# EAGLE design Amulet_watch_kite.d_companion (EAGLE 7.7.0)
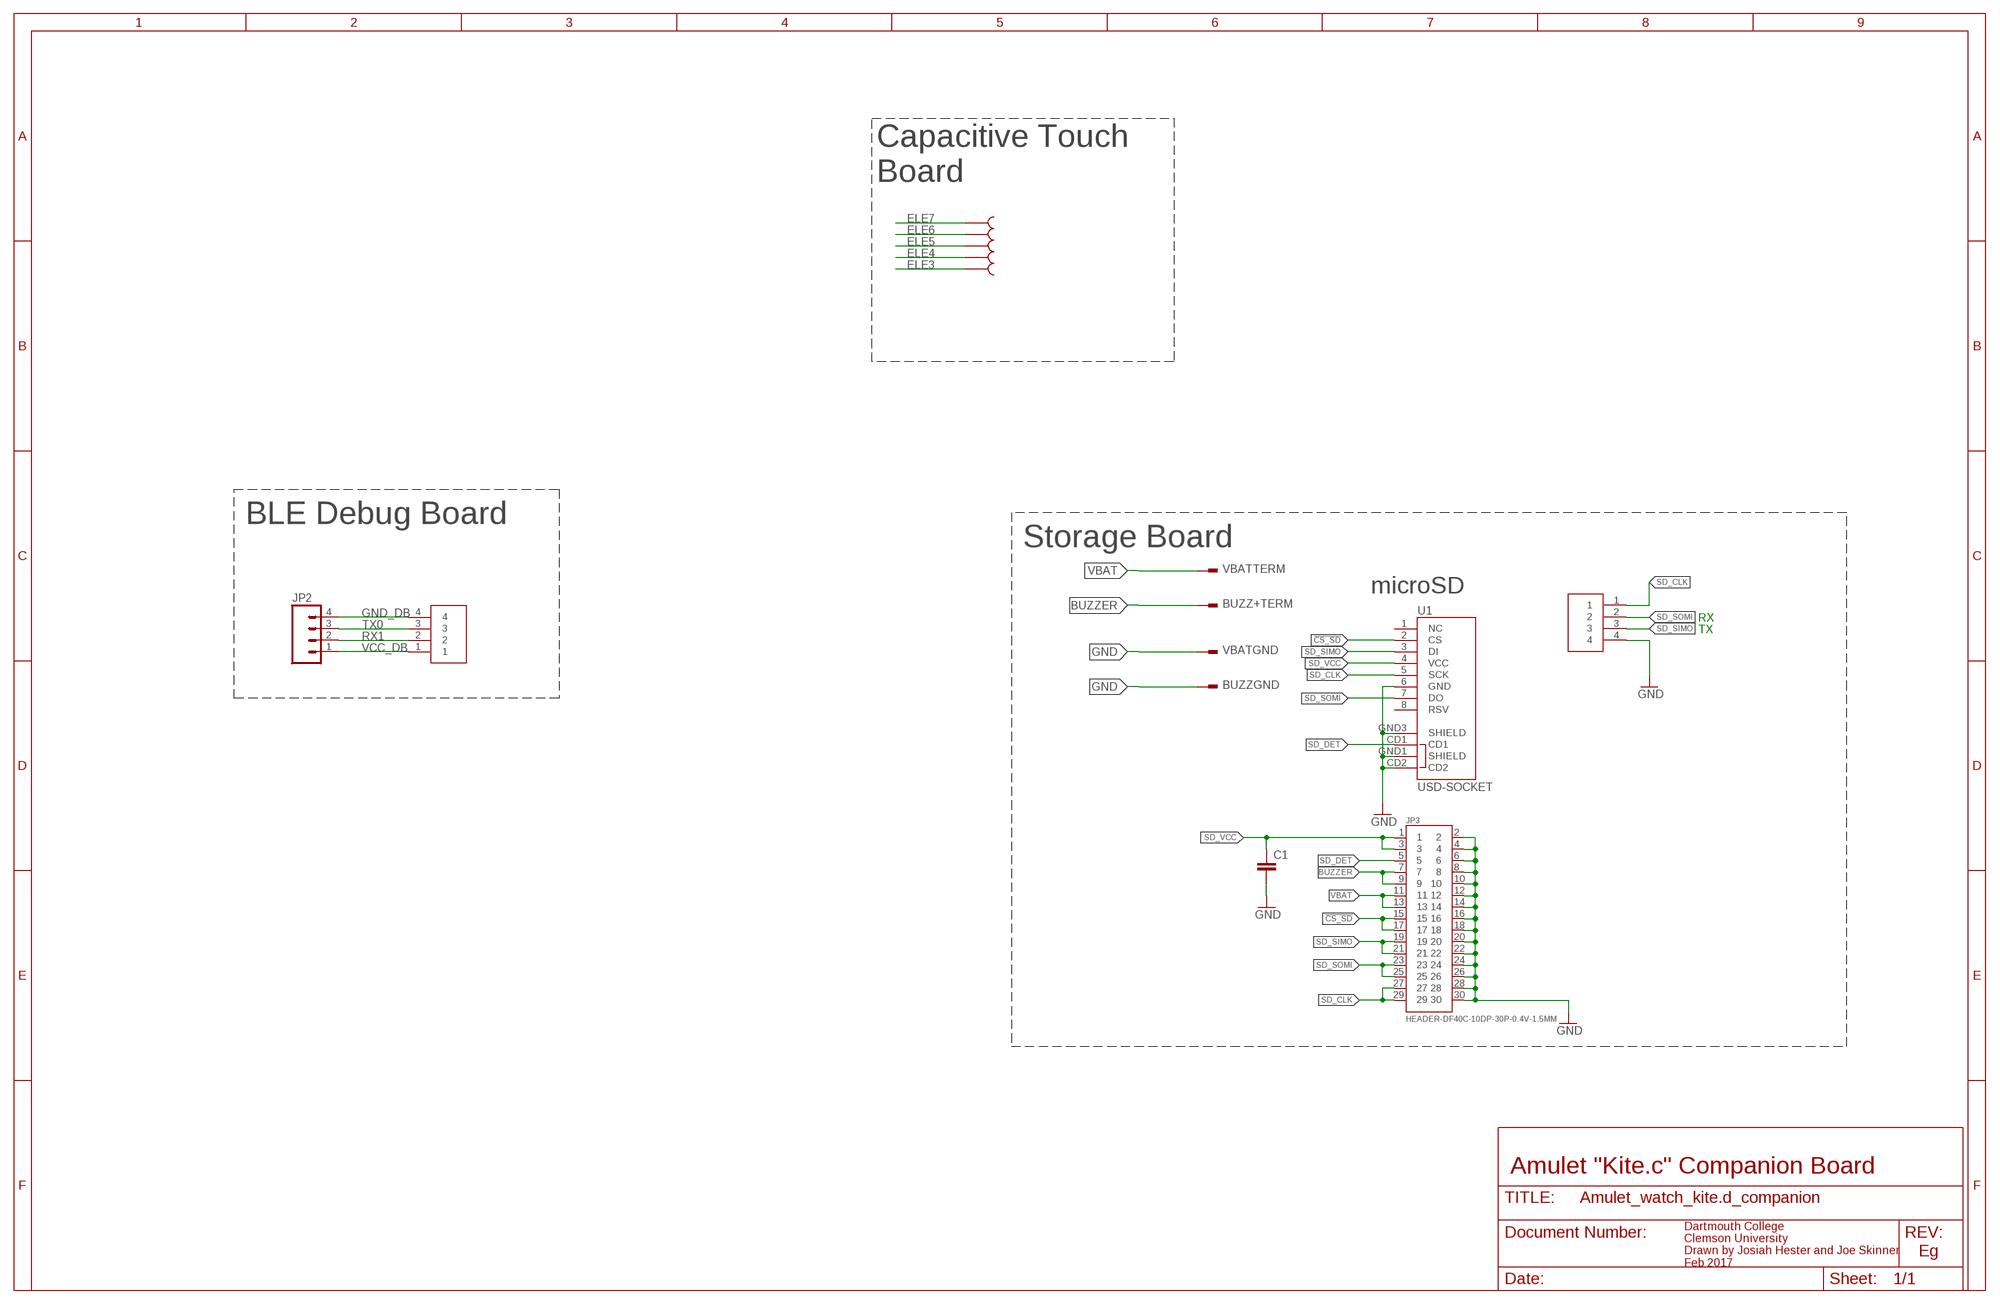
[diagram p0: schematic, sheet 1]

## Parts
BUZZ+TERM  KITE.C.TERMINAL  [BATTERY_TERMINAL]
BUZZGND  KITE.C.TERMINAL  [BATTERY_TERMINAL]
C1  CAP0805  [0805]
JP2  M04LOCK  [1X04_LOCK]
JP3  HEADER-DF40C-10DP-30P-0.4V-1.5MM  [HEADER-DF40-30]
U1  USD-SOCKET  [MICROSD_1:1]
U$1  CTPAD  [CTPAD]
U$2  CTPAD  [CTPAD]
U$3  CTPAD  [CTPAD]
U$4  CTPAD  [CTPAD]
U$5  CTPAD  [CTPAD]
U$11  1.27MM-MILLMAX  [1X03-1.27MM]
U$12  1.27MM-MILLMAX  [1X03-1.27MM]
VBATGND  KITE.C.TERMINAL  [BATTERY_TERMINAL]
VBATTERM  KITE.C.TERMINAL  [BATTERY_TERMINAL]

## Nets
!CS_SD: JP3.15 JP3.17 U1.2(CS)
BUZZER: BUZZ+TERM.P1 JP3.7 JP3.9
ELE3: U$5.P$1
ELE4: U$4.P$1
ELE5: U$3.P$1
ELE6: U$2.P$1
ELE7: U$1.P$1
GND: BUZZGND.P1 C1.2 JP3.2 JP3.4 JP3.6 JP3.8 JP3.10 JP3.12 JP3.14 JP3.16 JP3.18 JP3.20 JP3.22 JP3.24 JP3.26 JP3.28 JP3.30 U1.6(GND) U1.CD2 U1.GND1(SHIELD) U1.GND3(SHIELD) U$11.4 VBATGND.P1
GND_DB: JP2.4 U$12.4
RX1: JP2.2 U$12.2
SD_CLK: JP3.27 JP3.29 U1.5(SCK) U$11.1
SD_DET: JP3.5 U1.CD1
SD_SIMO: JP3.19 JP3.21 U1.3(DI) U$11.3
SD_SOMI: JP3.23 JP3.25 U1.7(DO) U$11.2
SD_VCC: C1.1 JP3.1 JP3.3 U1.4(VCC)
TX0: JP2.3 U$12.3
VBAT: JP3.11 JP3.13 VBATTERM.P1
VCC_DB: JP2.1 U$12.1
Unconnected: U1.1(NC) U1.8(RSV)

## Notes on the sheet
- Capacitive Touch
  Board
- BLE Debug Board
- Storage Board
- microSD
- RX
- TX
- Amulet "Kite.c" Companion Board
- Eg
- Dartmouth College
  Clemson University
  Drawn by Josiah Hester and Joe Skinner
  Feb 2017

## Library data of the parts
BUZZ+TERM BUZZGND VBATGND VBATTERM = CustomElectrodes:KITE.C.TERMINAL
C1 = SparkFun-Capacitors:CAP: Capacitor Standard 0603 ceramic capacitor, and 0.1" leaded capacitor.
JP2 = SparkFun-Connectors:M04: Header 4 Standard 4-pin 0.1" header. Use with straight break away headers (SKU : PRT-00116), right angle break away headers (PRT-00553), swiss pins (PRT-00743), machine pins (PRT-00117), and female headers (PRT-00115). Molex polarized connector foot print use with SKU : PRT-08231 with associated crimp pins and housings. 1MM SMD Version SKU: PRT-10208
JP3 = connectors:HEADER-DF40C-10DP-30P-0.4V-1.5MM: DF40 Series●0.4mm Pitch, 1.5 to 4.0mm Height, Board-to-Board and Board-to-FPC Connector 1.5mm Header (For use with shielded product) Digi-Key Part Number H11622CT-ND Quantity Available 3,874 Can ship immediately Manufacturer Hirose Electric Co Ltd </en/supplier-centers/h/hirose> Manufacturer Part Number DF40C-30DP-0.4V(51) Description 30 Position Connector Plug, Outer Shroud Contacts Surface Mount Gold Lead Free Status / RoHS Status Lead free / RoHS Compliant Moisture Sensitivity Level (MSL) 1 (Unlimited) Manufacturer Standard Lead Time 8 Weeks; DIGIKEY: H11622CT-ND
U1 = SparkFun-Connectors:USD-SOCKET: microSD Socket Push-push type uSD socket. Schematic element and footprint production proven. Spark Fun Electronics SKU : PRT-00127. tDoc lines correctly indicate media card edge positions when inserting (unlocked, locked, depressed). NOTE: CD1 and CD2 are connected internally; PROD_ID: CONN-07820
U$1-U$5 = captouch:CTPAD
U$11 U$12 = 1.27mm-headers:1.27MM-MILLMAX: Manafacturer: Mill-Max Manufacturing Corp. Manafacturer Part #: 851-13-004-40-001000 Description: 4 Position Receptacle Connector 0.050" (1.27mm) Surface Mount, Right Angle Gold; DIGIKEY: ED1324-ND

## Board
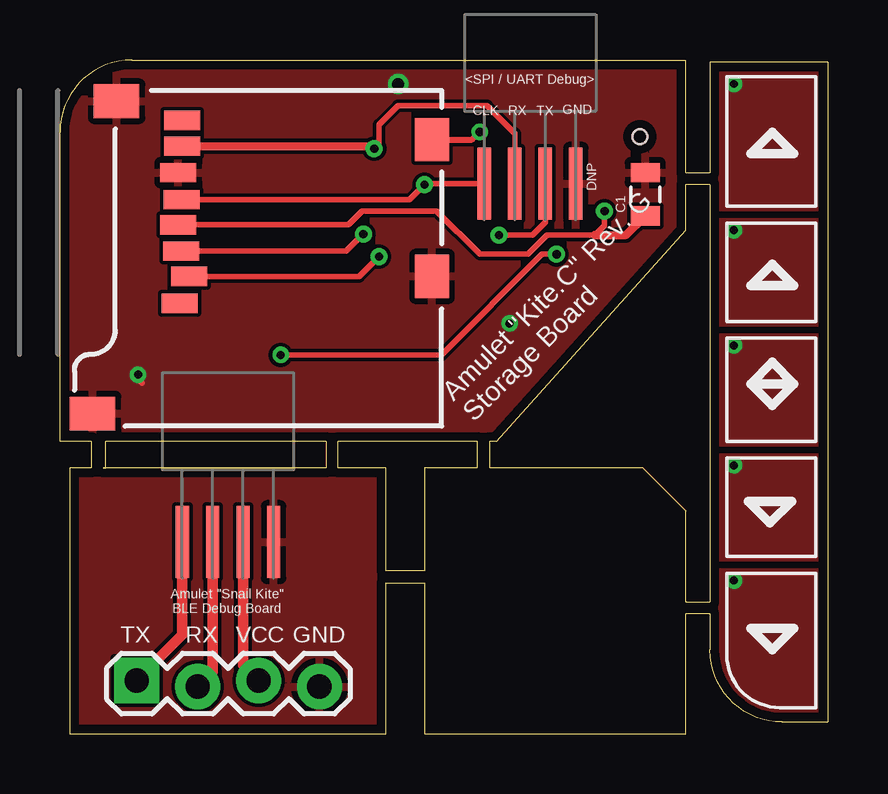
[diagram p1: board, top side]
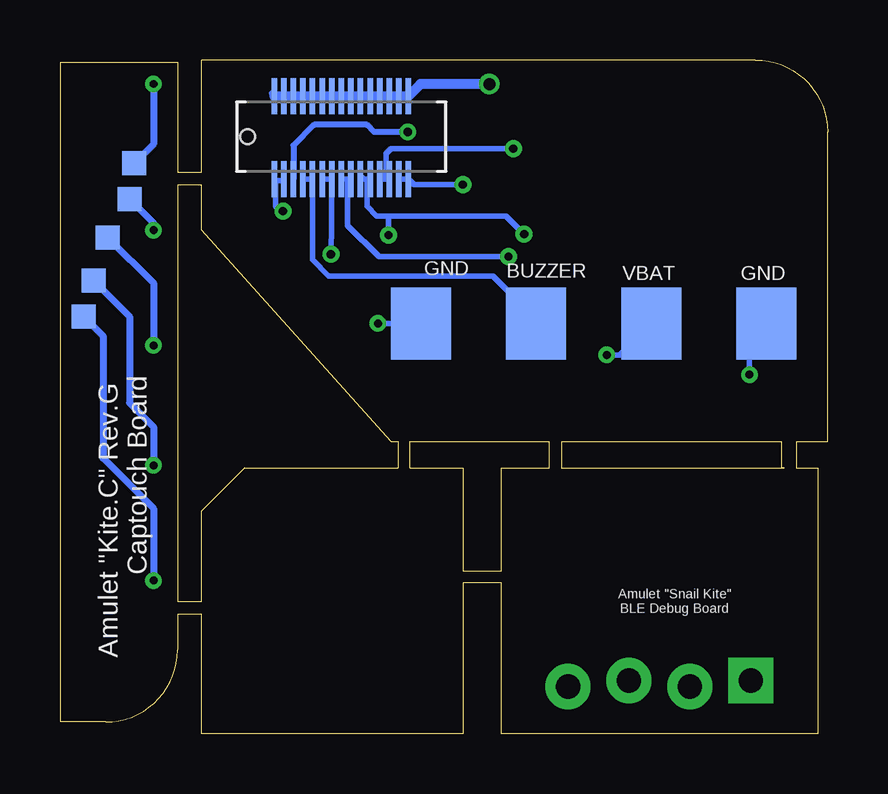
[diagram p2: board, bottom side, seen from below]

Size 32 x 28.1 mm. Coordinates in mm from the lower left corner, seen from the top.
Outline: 0,12.2 0,25.1 arc-90 3,28.1 26.1,28.1 26.1,23.4 27.1,23.4 27.1,28 32,28 32,0.5 30.1,0.5 arc-90 27.1,3.5 27.1,5 26.1,5 26.1,0 15.2,0 15.2,6.3 13.6,6.3 13.6,0 0.4,0 0.4,11.1 1.3,11.1 1.3,12.2 0,12.2
Outline: 18.2,12.2 17.9,12.2 17.9,11.1 19.4,11.1 20.1,11.1 24.3,11.1 26.1,9.3 26.1,5.5 27.1,5.5 27.1,22.9 26.1,22.9 26.1,21 18.2,12.2
Outline: 17.4,12.2 16.1,12.2 15.4,12.2 11.6,12.2 11.6,11.1 13.6,11.1 13.6,6.8 15.2,6.8 15.2,11.1 17.4,11.1 17.4,12.2
Outline: 11.1,12.2 1.9,12.2 1.9,11.1 1.8,11.1 11.1,11.1 11.1,12.2
Copper layers (1+16): Top 0.0356mm / dielectric 1.5011mm / Bottom 0.0356mm
Design rules "LaenPCBOrder *": minimum track width 6mil, minimum drill 13mil, track to track 6mil, track to pad 6mil, pad to pad 6mil, via to via 6mil, smd to smd 6mil, copper to edge 15mil, drill to drill 6mil, minimum pad ring 7mil, minimum via ring 7mil, stop-mask expansion 3mil, vias tented up to drill 0mil, thermal gap 10mil

### Footprints (pad centres in the part's own frame; a part is rotated, then mirrored left to right if it is on the bottom)
BATTERY_TERMINAL = smd 2.5 x 3: P1 0,0
0805 = smd 0.8 x 1.2: 1 -0.9,0; 2 0.9,0
1X04_LOCK = drill 1.016 pad 1.88 square: 1 0,0.127 | drill 1.016 pad 1.88: 2 2.54,-0.127; 3 5.08,0.127; 4 7.62,-0.127
HEADER-DF40-30 = smd 0.23 x 1.5: 1 -2.8,-1.76; 2 -2.8,1.7; 3 -2.4,-1.76; 4 -2.4,1.7; 5 -2,-1.76; 6 -2,1.7; 7 -1.6,-1.76; 8 -1.6,1.7; 9 -1.2,-1.76; 10 -1.2,1.7; 11 -0.8,-1.76; 12 -0.8,1.7; 13 -0.4,-1.76; 14 -0.4,1.7; 15 0,-1.76; 16 0,1.7; 17 0.4,-1.76; 18 0.4,1.7; 19 0.8,-1.76; 20 0.8,1.7; 21 1.2,-1.76; 22 1.2,1.7; 23 1.6,-1.76; 24 1.6,1.7; 25 2,-1.76; 26 2,1.7; 27 2.4,-1.76; 28 2.4,1.7; 29 2.8,-1.76; 30 2.8,1.7 | hole 0.6: -3.905,0
MICROSD_1:1 = smd 0.8 x 1.5: 1 5.096,10.919; 2 6.218,10.519; 3 7.274,10.853; 4 8.367,10.982; 5 9.421,10.828; 6 10.539,10.973; 7 11.648,10.819; 8 12.721,10.819 | smd 1.8 x 1.4: CD1 11.92,0.4; CD2 6.22,0.4 | smd 1.4 x 1.9: GND1 0.497,14.55; GND3 13.52,13.55
CTPAD = smd 1 x 1: P$1 0,0
1X03-1.27MM = smd 3 x 0.56: 1 -1.5,-1.905; 2 -1.5,-0.635; 3 -1.5,0.635; 4 -1.5,1.905

### Placement (x,y rotation side)
BUZZ+TERM  12.15,17.11 0 bottom
BUZZGND  16.95,17.11 0 bottom
C1  24.4,22.5 90 top
JP2  3.2,2.1 0 top
JP3  20.27,24.9 0 bottom
U1  15.91,12.86 90 top
U$1  31,17.4 0 bottom
U$2  30.6,18.9 0 bottom
U$3  30,20.7 0 bottom
U$4  29.1,22.3 0 bottom
U$5  28.9,23.8 0 bottom
U$11  19.6,21.44 270 top
U$12  7,6.5 270 top
VBATGND  2.54,17.11 0 bottom
VBATTERM  7.35,17.11 0 bottom

### Tracks (layer width: path | path; a pad name or v marks a point on that pad's centre or on a via)
!CS_SD  (via drill 0.35)
  Top 0.222: U1.2 12.48,19.08 v13.3,19.9
  Bottom 0.222: JP3.15 JP3.17 20,23.01 20,21.2 18.7,19.9 v13.3,19.9
BUZZER
  Bottom 0.222: JP3.7 JP3.9 21.47,19.77 20.8,19.1 13.96,19.1 12.15,17.29 BUZZ+TERM.P1
ELE3  (via drill 0.33)
  Bottom 0.3: v28.1,27.1 28.1,24.6 U$5.P$1
  pour Top: 27.2,28 32.1,28 32.1,21.9 27.2,21.9
ELE4  (via drill 0.33)
  Bottom 0.3: U$4.P$1 28.1,21.3 v28.1,21
  pour Top: 27.2,21.4 32.1,21.4 32.1,17.1 27.2,17.1
ELE5  (via drill 0.33)
  Bottom 0.3: U$3.P$1 28.1,18.8 v28.1,16.2
  pour Top: 27.2,16.6 32.1,16.6 32.1,12.1 27.2,12.1
ELE6  (via drill 0.33)
  Bottom 0.3: U$2.P$1 29.1,17.4 29.1,13.8 28.1,12.8 v28.1,11.2
  pour Top: 27.2,11.6 32.1,11.6 32.1,7.3 27.2,7.3
ELE7  (via drill 0.33)
  Bottom 0.3: U$1.P$1 30.2,16.6 30.2,11.5 28.1,9.4 v28.1,6.4
  pour Top: 32.1,6.8 27.2,6.8 27.3,0.2 31.9,0.2 arc90 32.1,3.6
GND  (via drill 0.33, 0.5)
  Top 0.222: v3.26,14.98 3.26,14.8 3.43,14.62 | v18.75,17.11 18.9,17.11
  Bottom 0.222: BUZZGND.P1 16.59,17.11 v18.75,17.11 | JP3.2 23.18,26.71 | VBATGND.P1 3.26,16.4 v3.26,14.98
  Bottom 0.4: JP3.30 JP3.28 JP3.26 JP3.24 JP3.22 JP3.20 JP3.18 JP3.16 JP3.14 JP3.12 JP3.10 JP3.8 JP3.6 JP3.4 JP3.2
  Bottom 0.406: v14.1,27.1 16.97,27.1 JP3.30
  pour Top: -0.1,28.6 -0.1,12.4 0,12.3 18.2,12.3 26.2,20.3 26.2,28.2 0.3,28.2
GND_DB
  pour Top: -2.4,11.2 13.8,11.2 13.8,-0.2 -2.4,-0.2
RX1
  Top 0.44: JP2.2 6.37,2.6 U$12.2
SD_CLK  (via drill 0.35)
  Top 0.222: U1.5 6.38,22.28 14.58,22.28 14.85,22.55 | 14.85,22.55 v15.2,22.9 | U$11.1 15.24,22.94 14.85,22.55
  Bottom 0.222: v15.2,22.9 16.2,22.9 17.23,22.9 JP3.29 JP3.27
SD_DET  (via drill 0.35)
  Top 0.254: U1.CD1 17.18,24.78 v17.5,25.1
  Bottom 0.254: v17.5,25.1 18.9,25.1 19.2,25.4 21.4,25.4 22.27,24.53 JP3.5
SD_SIMO  (via drill 0.35)
  Top 0.222: U1.3 11.93,20.13 v12.64,20.84 v12.65,20.84 | U$11.3 20.23,21.34 19.7,20.8 v18.3,20.8
  Bottom 0.222: 18.4,21.6 13.4,21.6 v12.65,20.85 v12.65,20.84 | 18.4,21.6 18.8,21.6 19.2,22 19.2,23.01 JP3.21 JP3.19 19.4,23.21 | v18.3,20.8 18.3,21.5 18.4,21.6
SD_SOMI  (via drill 0.35)
  Top 0.222: U$11.2 18.96,25.04 17.8,26.2 14.1,26.2 13.3,25.4 13.3,24.6 v13.1,24.4
  Top 0.34: U1.7 12.99,24.51 v13.1,24.4
  Bottom 0.222: v13.1,24.4 18.2,24.4 18.4,24.2 18.4,23.27 JP3.25 JP3.23 18.4,23.41
SD_VCC  (via drill 0.35)
  Top 0.222: U1.4 12.03,21.23 12.6,21.8 15.7,21.8 17.5,20 19.5,20 20.3,20.8 22.3,20.8 22.7,21.2 v22.7,21.8
  Top 0.333: 22.3,20.8 23.6,20.8 C1.1
  Bottom 0.222: v22.7,21.8 22.8,21.8 23,22 23,23.07 | 23,23.07 JP3.1 | 23,23.07 22.74,23.07 JP3.3
TX0
  Top 0.44: JP2.3 7.63,2.87 U$12.3
VBAT  (via drill 0.33, 0.35)
  Top 0.222: 20.5,20 v20.7,20 20.1,20 15.9,15.8 v9.2,15.8
  Bottom 0.222: v20.7,20 20.67,21.27 JP3.13 JP3.11 | v9.2,15.8 8.66,15.8 VBATTERM.P1
VCC_DB
  Top 0.44: JP2.1 5.09,4.12 U$12.1

### Text on the board
tPlace: <SPI / UART Debug> | CLK | RX | TX | GND | DNP | Amulet "Kite.C" Rev. G / Storage Board | Amulet "Snail Kite" / BLE Debug Board | TX | RX | VCC | GND
bPlace: GND | VBAT | BUZZER | GND | Amulet "Kite.C" Rev.G / Captouch Board | Amulet "Snail Kite" / BLE Debug Board